# EasyEDA schematic OS Siding Board schematic.json
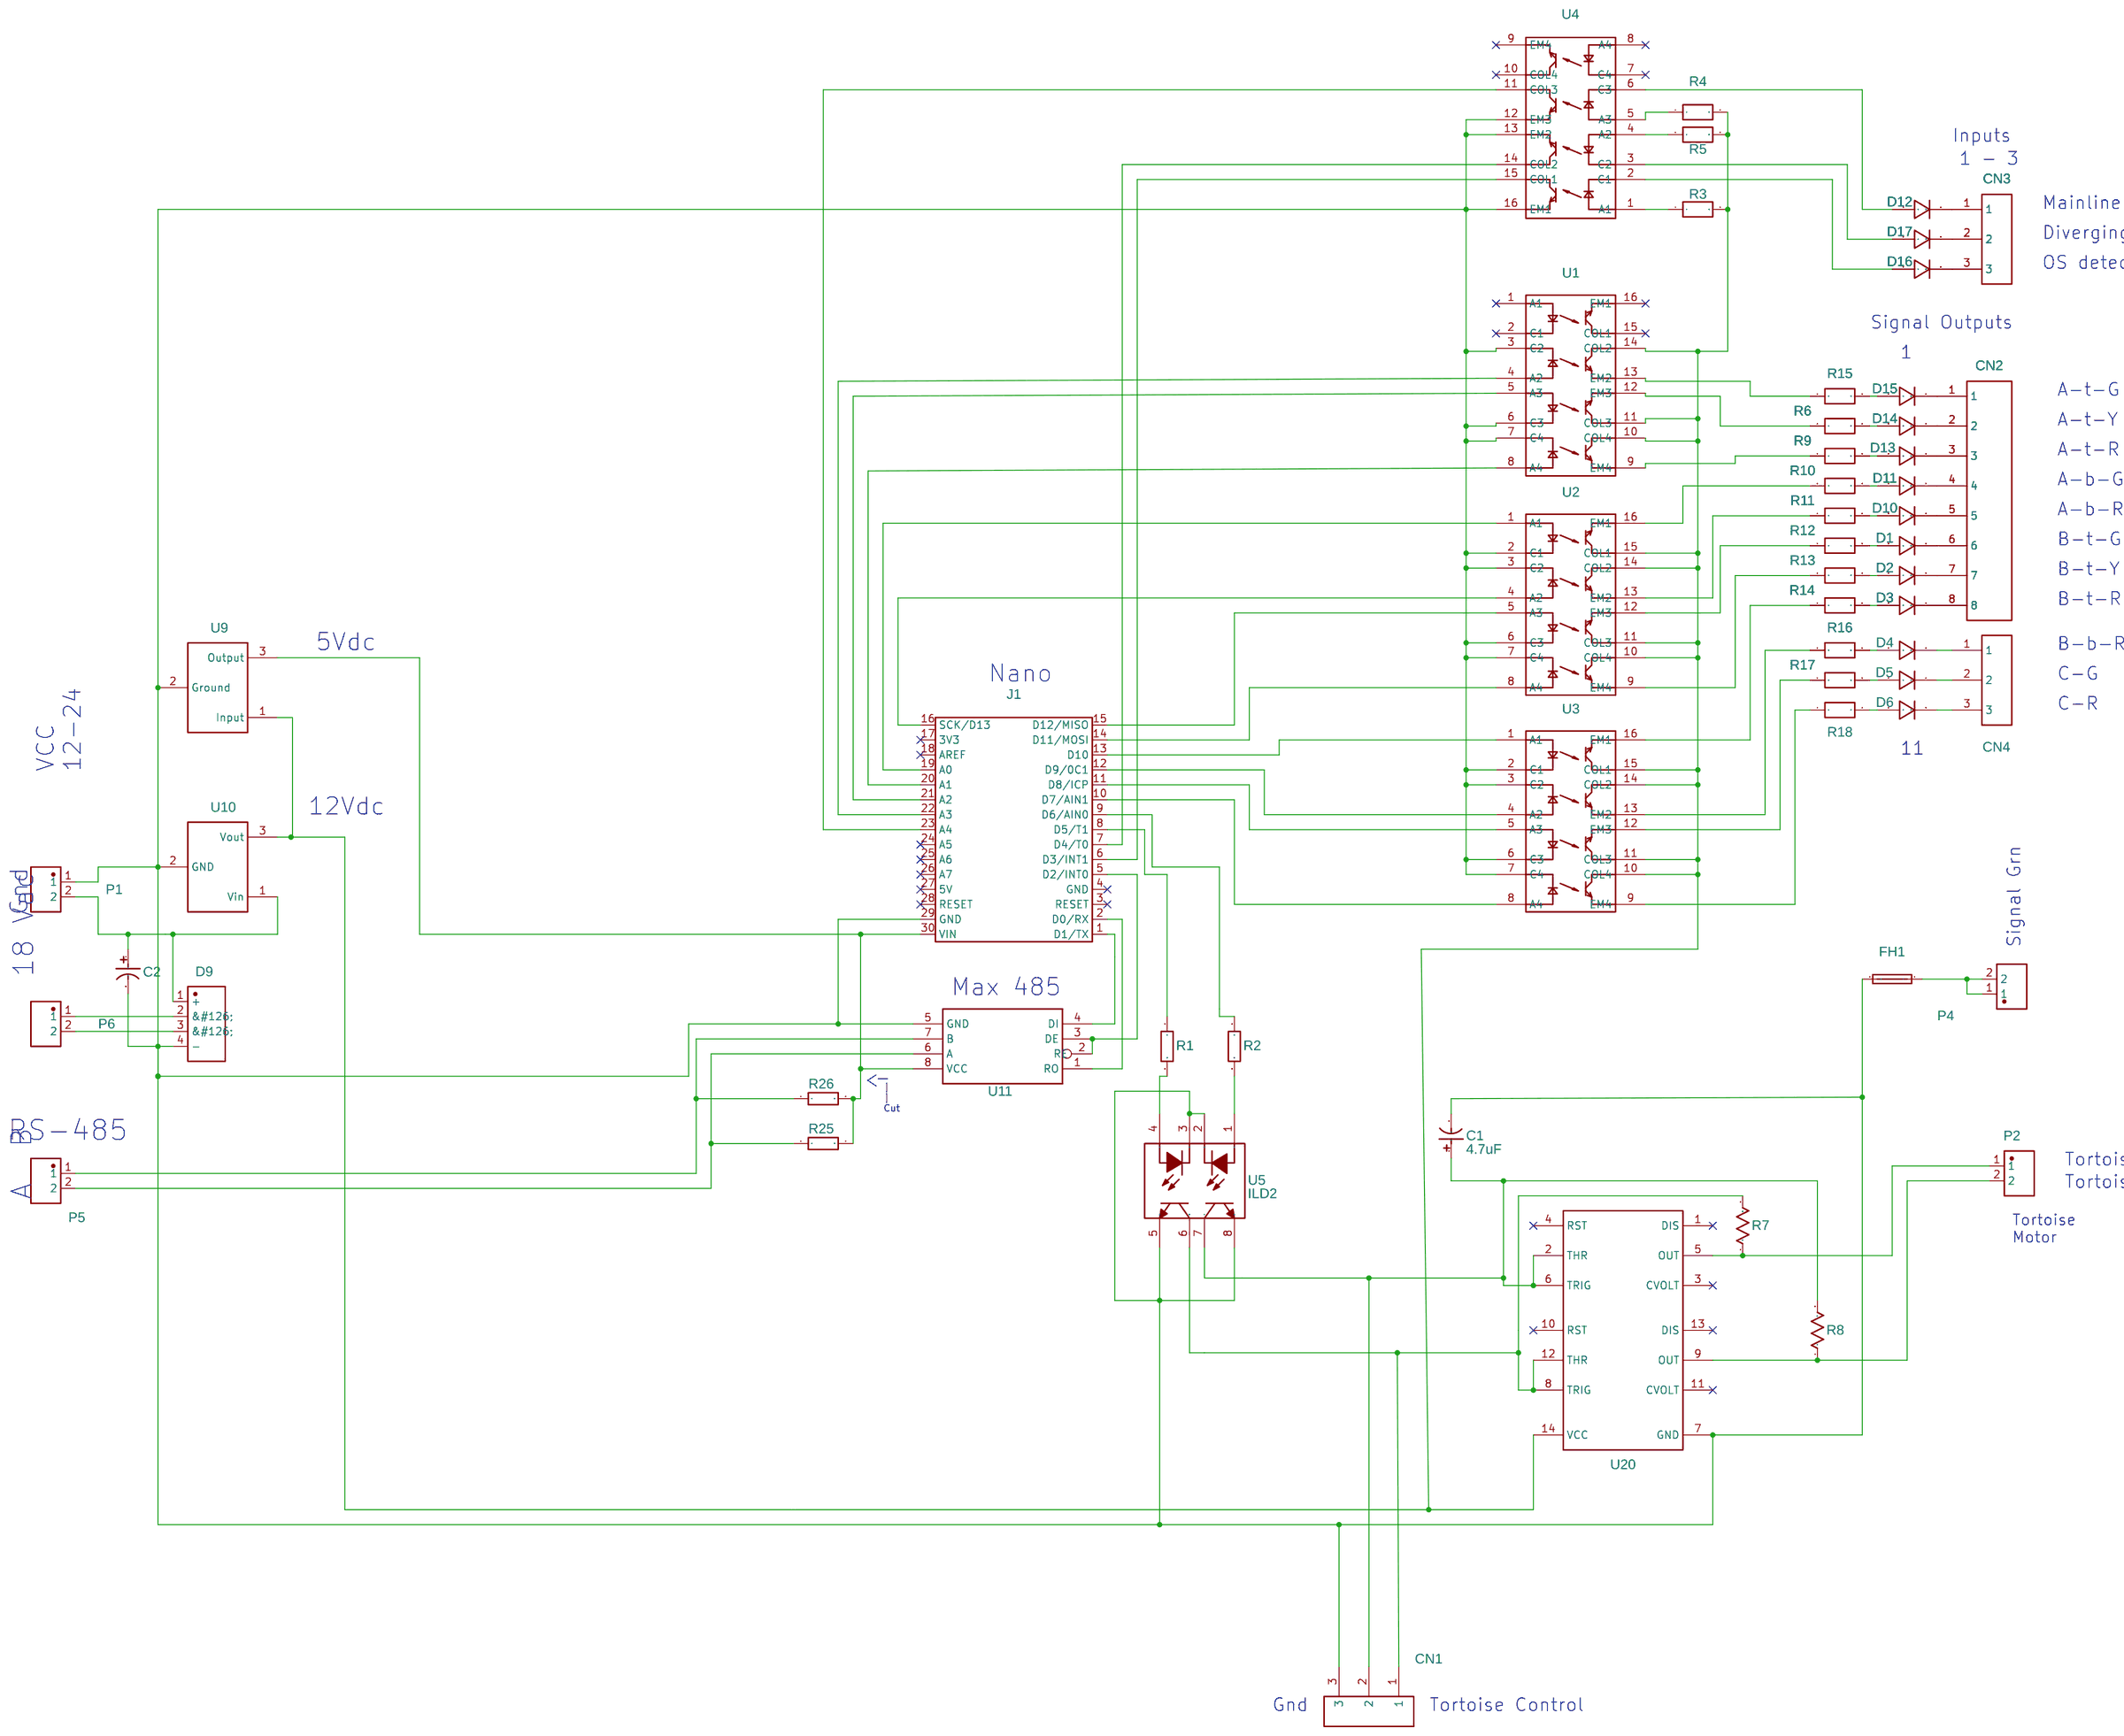
[diagram p0: schematic sheet]

## Parts
C1  4.7uF  [CAP-TH_BD4.0-P1.50-D0.8-FD]
C2  470uF  [CAP-TH_BD16.0-P7.50-D1.2-FD]
CN1  WJ25C-B-7.62-3P-13-00A  [WJ25C-B-7.62-3P]
CN2  WJ25C-B-7.62-8P-13-00A  [WJ25C-B-7.62-8P]
CN3  WJ25C-B-7.62-3P-13-00A  [WJ25C-B-7.62-3P]
CN4  WJ25C-B-7.62-3P-13-00A  [WJ25C-B-7.62-3P]
D1  1N4001  [DO-41]
D2  1N4001  [DO-41]
D3  1N4001  [DO-41]
D4  1N4001  [DO-41]
D5  1N4001  [DO-41]
D6  1N4001  [DO-41]
D9  D50SB100  [DIO-BG-TH_DXXSBXX]
D10  1N4001  [DO-41]
D11  1N4001  [DO-41]
D12  1N4001  [DO-41]
D13  1N4001  [DO-41]
D14  1N4001  [DO-41]
D15  1N4001  [DO-41]
D16  1N4001  [DO-41]
D17  1N4001  [DO-41]
FH1  64600001003  [FUSE-2P-25.8X9.0]
J1  Arduino_Nano_Header  [DIP-30_L43.18-W15.24-ARDUINONANO]
P1  WJ25C-B-2P  [CONN-TH_2P-P7.62_WJ25C-B-7.62-2P]
P2  WJ25C-B-2P  [CONN-TH_2P-P7.62_WJ25C-B-7.62-2P]
P4  WJ25C-B-2P  [CONN-TH_2P-P7.62_WJ25C-B-7.62-2P]
P5  WJ25C-B-2P  [CONN-TH_2P-P7.62_WJ25C-B-7.62-2P]
P6  WJ25C-B-2P  [CONN-TH_2P-P7.62_WJ25C-B-7.62-2P]
R1  150  [RES-TH_BD2.2-L6.5-P10.50-D0.6]
R2  150  [RES-TH_BD2.2-L6.5-P10.50-D0.6]
R3  680  [RES-TH_BD2.4-L6.3-P10.30-D0.6]
R4  680  [RES-TH_BD2.4-L6.3-P10.30-D0.6]
R5  680  [RES-TH_BD2.4-L6.3-P10.30-D0.6]
R6  390  [RES-TH_BD2.4-L6.3-P10.30-D0.6]
R7  10k  [PKG-0.25W RESISTOR]
R8  10k  [PKG-0.25W RESISTOR]
R9  390  [RES-TH_BD2.4-L6.3-P10.30-D0.6]
R10  390  [RES-TH_BD2.4-L6.3-P10.30-D0.6]
R11  390  [RES-TH_BD2.4-L6.3-P10.30-D0.6]
R12  390  [RES-TH_BD2.4-L6.3-P10.30-D0.6]
R13  390  [RES-TH_BD2.4-L6.3-P10.30-D0.6]
R14  390  [RES-TH_BD2.4-L6.3-P10.30-D0.6]
R15  390  [RES-TH_BD2.4-L6.3-P10.30-D0.6]
R16  390  [RES-TH_BD2.4-L6.3-P10.30-D0.6]
R17  390  [RES-TH_BD2.4-L6.3-P10.30-D0.6]
R18  390  [RES-TH_BD2.4-L6.3-P10.30-D0.6]
R25  10K  [AXIAL-0.4]
R26  10K  [AXIAL-0.4]
U1  ILQ2  [DIP-16_L19.8-W6.5-P2.54-LS7.6-BL]
U2  ILQ2  [DIP-16_L19.8-W6.5-P2.54-LS7.6-BL]
U3  ILQ2  [DIP-16_L19.8-W6.5-P2.54-LS7.6-BL]
U4  ILQ2  [DIP-16_L19.8-W6.5-P2.54-LS7.6-BL]
U5  ILD2  [DIP-8_L9.7-W6.4-P2.54-LS7.6-BL]
U9  MC7805BTG  [TO-220-3_L10.0-W4.5-P2.54-L]
U10  CJ7812  [TO-220-3_L10.0-W4.5-P2.54-L]
U11  MAX485DIL  [DIP8]
U20  LM556CN  [DIP14]

## Library data of the parts
C1 = 4.7uF 50V 4*7: Supplier: LCSC; Manufacturer: ValuePro; Supplier Part: C43841
C2 = 470uF 100V 16*25: Supplier: LCSC; Manufacturer: ValuePro; Supplier Part: C72551
CN1 CN3 CN4 = WJ25C-B-7.62-3P-13-00A: Supplier: LCSC; Manufacturer: ReliaPro; image: //image.lceda.cn/szlcsc/C61583.jpg; Supplier Part: C61583
CN2 = -: Supplier: LCSC; Manufacturer: ReliaPro; image: //image.lceda.cn/szlcsc/C49492.jpg; Supplier Part: C49492
D1-D6 D10-D17 = -: Supplier Part: C169150; Supplier: LCSC; Manufacturer: DIOFIT; Contributor: LCSC
D9 = -: Supplier: LCSC; Supplier Part: C411148; Manufacturer: Leshan Radio; Contributor: LCSC
FH1 = -: Supplier: LCSC; Supplier Part: C206887; Manufacturer: Littelfuse; Contributor: LCSC
P1 P2 P4-P6 = -: Supplier: LCSC; Manufacturer: ReliaPro; image: //image.lceda.cn/szlcsc/C8422.jpg; Supplier Part: C8422
R1 R2 = CFR0W4J0151A50: Supplier: LCSC; Manufacturer: UniOhm; Supplier Part: C70814
R3-R5 = RD 1/4W 680R J T/B A1: Supplier: LCSC; Supplier Part: C433698; Manufacturer: TyoHM; Contributor: LCSC
R6 R9-R18 = RD 1/4W 390R J T/B A1: Supplier: LCSC; Supplier Part: C433722; Manufacturer: TyoHM; Contributor: LCSC
R7 R8 = -: Power: 1/4W; Tolerance: ±5%; Supplier Part: 9339116; Supplier: Element14; Manufacturer: MULTICOMP; Manufacturer Part: RESISTOR_ALONG; Link: http://www.farnell.com/datasheets/1716725.pdf?_ga=2.130313612.2023696496.1506695686-238689616.1505921947&_gac=1.45287312.1506011718.EAIaIQobChMI57GX6tq21gIVTzobCh2WXgT2EAAYASAAEgKn9_D_BwE; Contributor: adelmar.azevedo
R25 R26 = CFR0W4J0103A50: Supplier: LCSC; Manufacturer: UniOhm; Supplier Part: C61299
U1-U4 = ILQ2: Supplier: LCSC; Manufacturer: VISHAY; Contributor: LCSC; Supplier Part: C145338
U5 = ILD2: Supplier: LCSC; Manufacturer: VISHAY; Supplier Part: C10612
U9 = -: Supplier: LCSC; Manufacturer: ON; image: //image.lceda.cn/szlcsc/C45385.jpg; Supplier Part: C45385
U10 = -: Supplier: LCSC; Manufacturer: CJ; image: //image.lceda.cn/szlcsc/C77894.jpg; Supplier Part: C77894
U11 = -: RS-485 transceiver; Contributor: SparkFun
U20 = -: Dual Timer, 14-pin MDIP; Manufacturer Part: ?

## Nets
Net-(C1-1): C1.1 CN1.2 R8.2 U5.7 U20.2(THR) U20.6(TRIG)
Net-(C1-2): C1.2 C2.2 CN1.3 D9.4(-) FH1.2 J1.29(GND) P1.1 U1.3(C2) U1.6(C3) U1.7(C4) U2.2(C1) U2.3(C2) U2.6(C3) U2.7(C4) U3.2(C1) U3.3(C2) U3.6(C3) U3.7(C4) U4.12(EM3) U4.13(EM2) U4.16(EM1) U5.2 U5.3 U5.5 U5.8 U9.2(Ground) U10.2(GND) U11.5(GND) U20.7(GND)
Net-(C2-1): C2.1 D9.1(+) P1.2 U10.1(Vin)
Net-(CN1-1): CN1.1 R7.2 U5.6 U20.8(TRIG) U20.12(THR)
Net-(CN2-1): CN2.1 D15.2
Net-(CN2-2): CN2.2 D14.2
Net-(CN2-3): CN2.3 D13.2
Net-(CN2-4): CN2.4 D11.2
Net-(CN2-5): CN2.5 D10.2
Net-(CN2-6): CN2.6 D1.2
Net-(CN2-7): CN2.7 D2.2
Net-(CN2-8): CN2.8 D3.2
Net-(CN3-1): CN3.1 D12.2
Net-(CN3-2): CN3.2 D17.2
Net-(CN3-3): CN3.3 D16.2
Net-(CN4-1): CN4.1 D4.2
Net-(CN4-2): CN4.2 D5.2
Net-(CN4-3): CN4.3 D6.2
Net-(D1-1): D1.1 R12.2
Net-(D2-1): D2.1 R13.2
Net-(D3-1): D3.1 R14.2
Net-(D4-1): D4.1 R16.2
Net-(D5-1): D5.1 R17.2
Net-(D6-1): D6.1 R18.2
Net-(D9-2): D9.2(&#126;) P6.1
Net-(D9-3): D9.3(&#126;) P6.2
Net-(D10-1): D10.1 R11.2
Net-(D11-1): D11.1 R10.2
Net-(D12-1): D12.1 U4.6(C3)
Net-(D13-1): D13.1 R9.2
Net-(D14-1): D14.1 R6.2
Net-(D15-1): D15.1 R15.2
Net-(D16-1): D16.1 U4.2(C1)
Net-(D17-1): D17.1 U4.3(C2)
Net-(FH1-1): FH1.1 P4.1 P4.2
Net-(J1-1): J1.1(D1/TX) U11.4(DI)
Net-(J1-2): J1.2(D0/RX) U11.1(RO)
Net-(J1-5): J1.5(D2/INT0) U11.2(RE) U11.3(DE)
Net-(J1-6): J1.6(D3/INT1) U4.15(COL1)
Net-(J1-7): J1.7(D4/T0) U4.14(COL2)
Net-(J1-8): J1.8(D5/T1) R1.1
Net-(J1-9): J1.9(D6/AIN0) R2.1
Net-(J1-10): J1.10(D7/AIN1) U3.8(A4)
Net-(J1-11): J1.11(D8/ICP) U3.5(A3)
Net-(J1-12): J1.12(D9/0C1) U3.4(A2)
Net-(J1-13): J1.13(D10) U3.1(A1)
Net-(J1-14): J1.14(D11/MOSI) U2.8(A4)
Net-(J1-15): J1.15(D12/MISO) U2.5(A3)
Net-(J1-16): J1.16(SCK/D13) U2.4(A2)
Net-(J1-19): J1.19(A0) U2.1(A1)
Net-(J1-20): J1.20(A1) U1.8(A4)
Net-(J1-21): J1.21(A2) U1.5(A3)
Net-(J1-22): J1.22(A3) U1.4(A2)
Net-(J1-23): J1.23(A4) U4.11(COL3)
Net-(J1-30): J1.30(VIN) R25.2 R26.2 U9.3(Output) U11.8(VCC)
Net-(P2-1): P2.1 R7.1 U20.5(OUT)
Net-(P2-2): P2.2 R8.1 U20.9(OUT)
Net-(P5-1): P5.1 R26.1 U11.7(B)
Net-(P5-2): P5.2 R25.1 U11.6(A)
Net-(R1-2): R1.2 U5.4
Net-(R2-2): R2.2 U5.1
Net-(R3-1): R3.1 U4.1(A1)
Net-(R3-2): R3.2 R4.2 R5.2 U1.10(COL4) U1.11(COL3) U1.14(COL2) U2.10(COL4) U2.11(COL3) U2.14(COL2) U2.15(COL1) U3.10(COL4) U3.11(COL3) U3.14(COL2) U3.15(COL1) U9.1(Input) U10.3(Vout) U20.14(VCC)
Net-(R4-1): R4.1 U4.5(A3)
Net-(R5-1): R5.1 U4.4(A2)
Net-(R6-1): R6.1 U1.12(EM3)
Net-(R9-1): R9.1 U1.9(EM4)
Net-(R10-1): R10.1 U2.16(EM1)
Net-(R11-1): R11.1 U2.13(EM2)
Net-(R12-1): R12.1 U2.12(EM3)
Net-(R13-1): R13.1 U2.9(EM4)
Net-(R14-1): R14.1 U3.16(EM1)
Net-(R15-1): R15.1 U1.13(EM2)
Net-(R16-1): R16.1 U3.13(EM2)
Net-(R17-1): R17.1 U3.12(EM3)
Net-(R18-1): R18.1 U3.9(EM4)

Not connected (* = marked no-connect by the designer): J1 3(RESET)* 4(GND)* 17(3V3)* 18(AREF)* 24(A5)* 25(A6)* 26(A7)* 27(5V)* 28(RESET)*; U1 1(A1)* 2(C1)* 15(COL1)* 16(EM1)*; U4 7(C4)* 8(A4)* 9(EM4)* 10(COL4)*; U20 1(DIS)* 3(CVOLT)* 4(RST)* 10(RST)* 11(CVOLT)* 13(DIS)*

## Notes on the sheet
- Inputs
- 1 - 3
- Mainline
- Diverging
- OS detection
- Signal Outputs
- 1
- A-t-G
- A-t-Y
- A-t-R
- A-b-G
- A-b-R
- B-t-G
- B-t-Y
- B-t-R
- 5Vdc
- B-b-R
- Nano
- C-G
- C-R
- 11
- VCC
  12-24
- 12Vdc
- Gnd
- Signal Grn
- 18 Vac
- Max 485
- |
  |
  Cut
- /\
   |
- RS-485
- B
- Tortoise pin 1
- Tortoise pin 8
- A
- Tortoise
  Motor
- Gnd
- Tortoise Control
